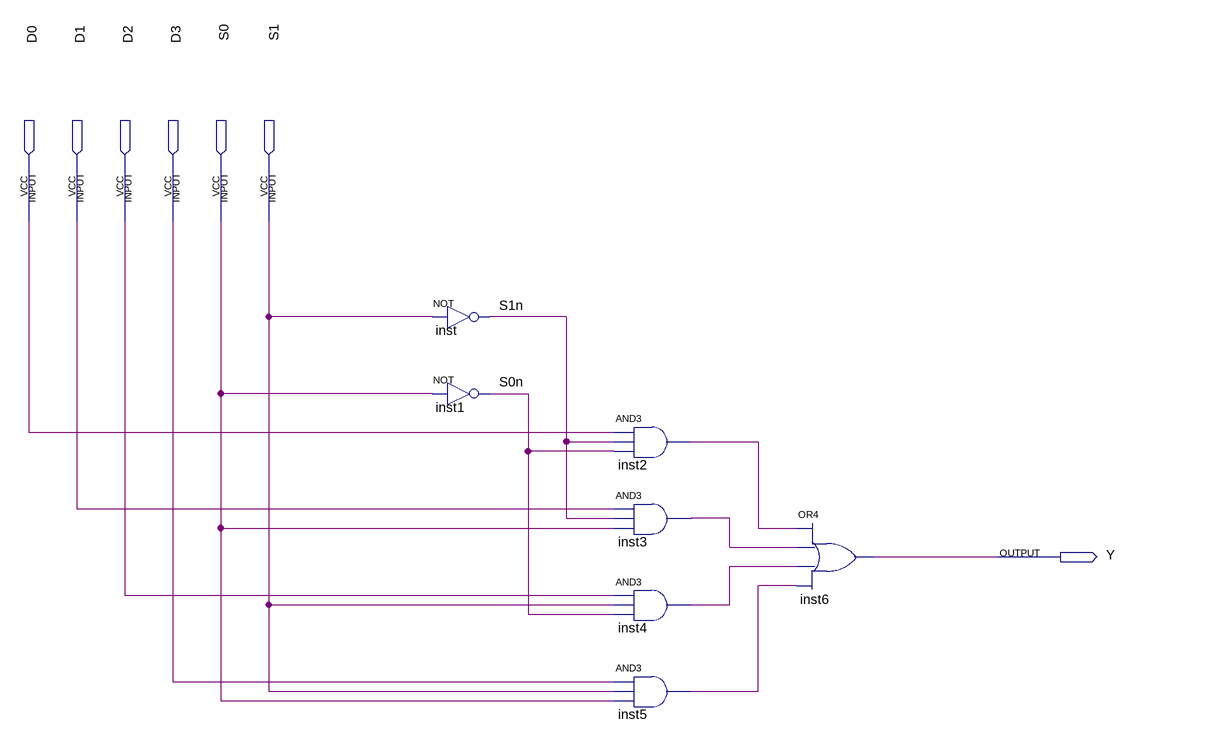
[diagram p0: schematic sheet]
// Quartus schematic MUX4A1.bdf as structural Verilog: 7 symbols, 7 pins
module MUX4A1 (
  input  D0,
  input  D1,
  input  D2,
  input  D3,
  input  S0,
  input  S1,
  output Y
);

  wire inst2_out, inst3_out, inst4_out, inst5_out, S0n, S1n;

  not inst (S1n, S1);
  not inst1 (S0n, S0);
  and inst2 (inst2_out, D0, S1n, S0n);
  and inst3 (inst3_out, D1, S1n, S0);
  and inst4 (inst4_out, D2, S1, S0n);
  and inst5 (inst5_out, D3, S1, S0);
  or inst6 (Y, inst2_out, inst3_out, inst4_out, inst5_out);
endmodule
